# EAGLE design scHnRk_4 (EAGLE 7.5.0)
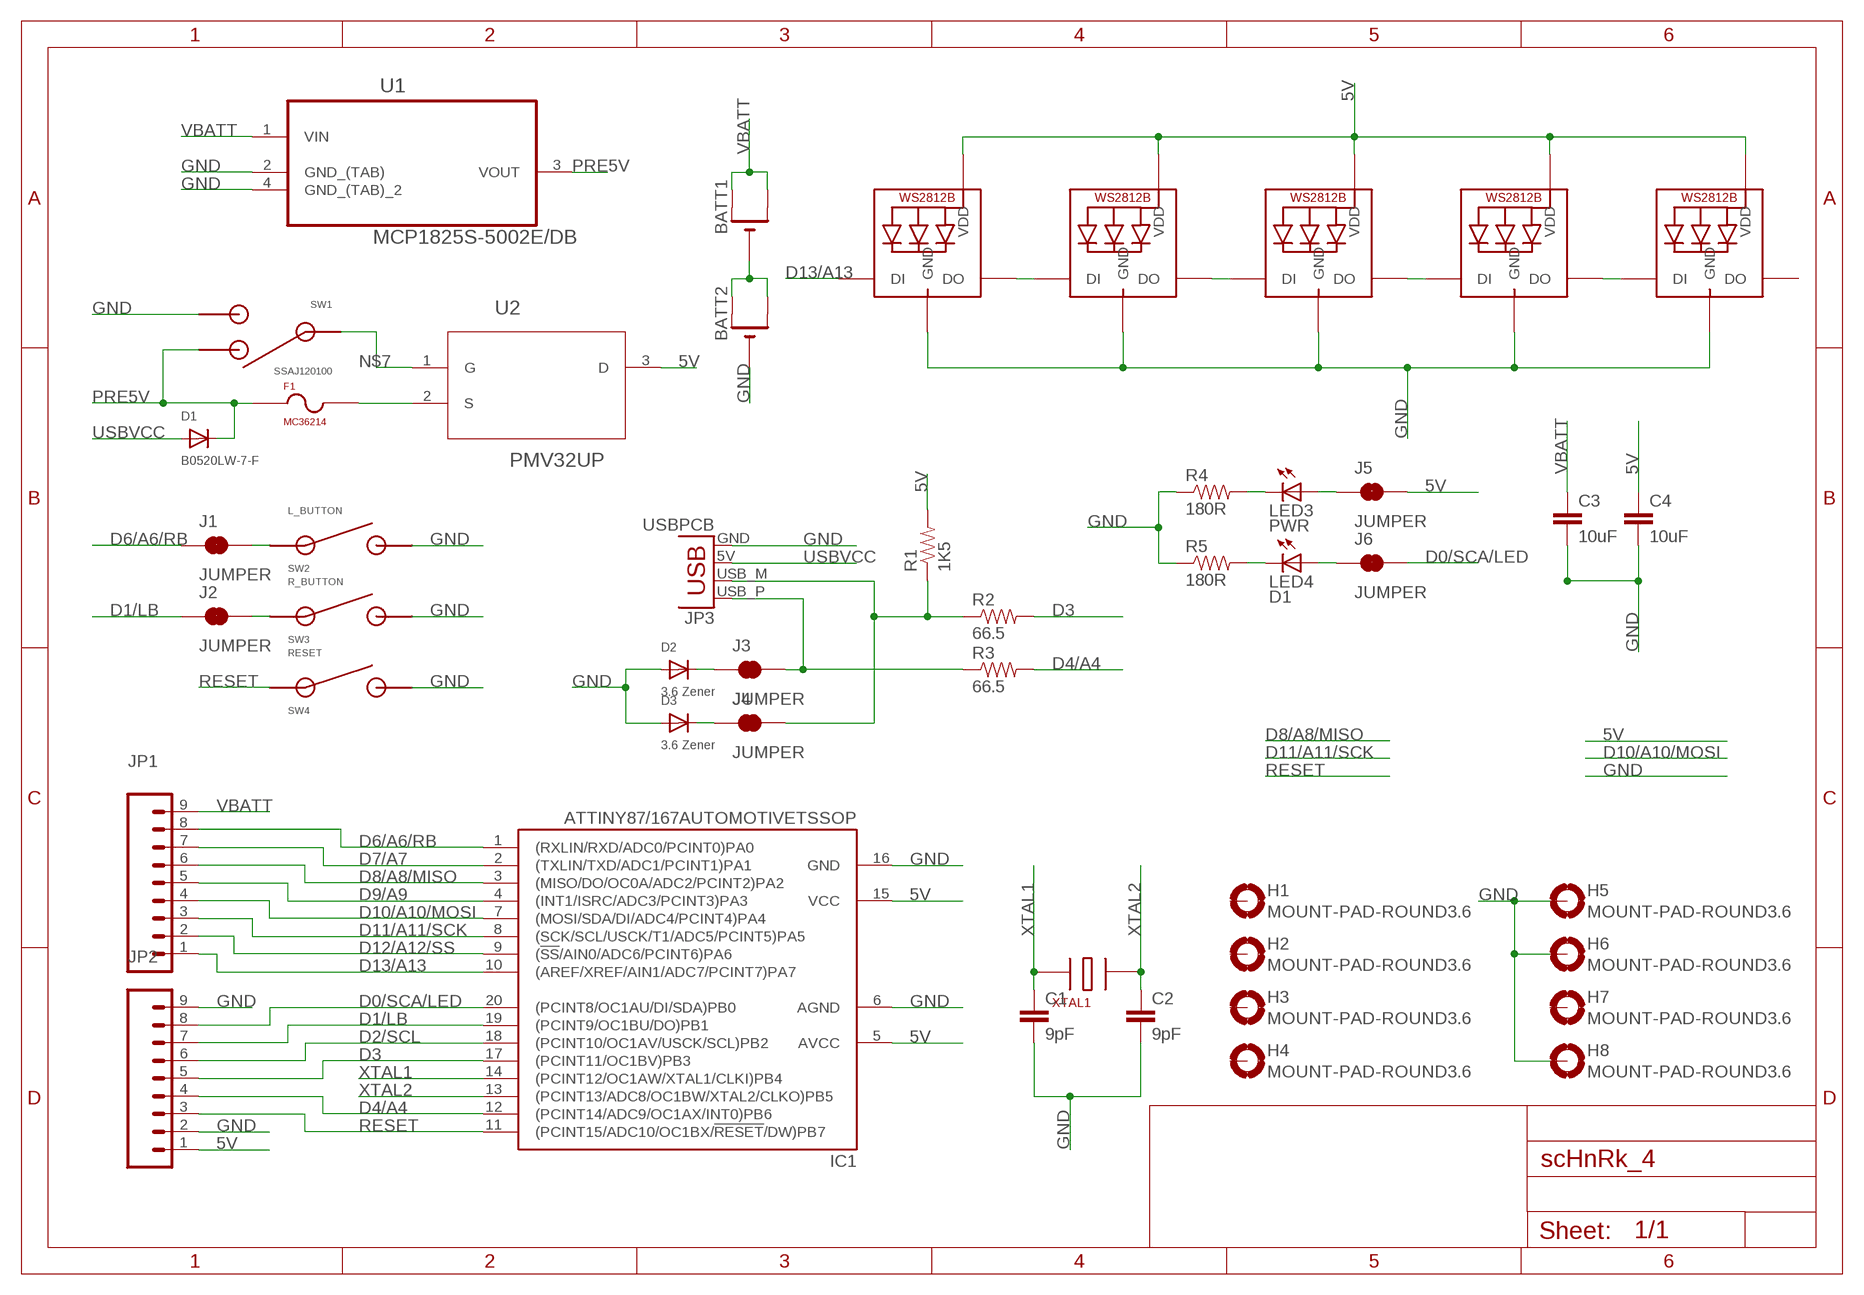
[diagram p0: schematic, sheet 1]

## Parts
BATT1  CR2032SMT  [CR2032-SMD]
BATT2  CR2032SMT  [CR2032-SMD]
C1  9pF  CAP0603-CAP  [0603-CAP]
C2  9pF  CAP0603-CAP  [0603-CAP]
C3  10uF  CAP0805  [0805]
C4  10uF  CAP0805  [0805]
D1  B0520LW-7-F  DIODESOD-123  [SOD-123]
D2  3.6 Zener  DIODESOD-523  [SOD-523]
D3  3.6 Zener  DIODESOD-523  [SOD-523]
F1  MC36214  [MC36214]
H1  MOUNT-PAD-ROUND3.6  [3,6-PAD]
H2  MOUNT-PAD-ROUND3.6  [3,6-PAD]
H3  MOUNT-PAD-ROUND3.6  [3,6-PAD]
H4  MOUNT-PAD-ROUND3.6  [3,6-PAD]
H5  MOUNT-PAD-ROUND3.6  [3,6-PAD]
H6  MOUNT-PAD-ROUND3.6  [3,6-PAD]
H7  MOUNT-PAD-ROUND3.6  [3,6-PAD]
H8  MOUNT-PAD-ROUND3.6  [3,6-PAD]
IC1  ATTINY87/167AUTOMOTIVETSSOP  [TSSOP20]
J1  JUMPER  JUMPER-PAD-2-NC_BY_TRACE  [PAD-JUMPER-2-NC_BY_TRACE_YES_SILK]
J2  JUMPER  JUMPER-PAD-2-NC_BY_TRACE  [PAD-JUMPER-2-NC_BY_TRACE_YES_SILK]
J3  JUMPER  JUMPER-PAD-2-NC_BY_TRACE  [PAD-JUMPER-2-NC_BY_TRACE_YES_SILK]
J4  JUMPER  JUMPER-PAD-2-NC_BY_TRACE  [PAD-JUMPER-2-NC_BY_TRACE_YES_SILK]
J5  JUMPER  JUMPER-PAD-2-NC_BY_TRACE  [PAD-JUMPER-2-NC_BY_TRACE_YES_SILK]
J6  JUMPER  JUMPER-PAD-2-NC_BY_TRACE  [PAD-JUMPER-2-NC_BY_TRACE_YES_SILK]
JP1  M09  [1X09]
JP2  M09  [1X09]
JP3  USBPCB  [USB-A-PCB]
LED1  WS2812B5050  [WS2812B]
LED2  WS2812B5050  [WS2812B]
LED3  PWR  LEDCHIPLED_0603  [CHIPLED_0603]
LED4  D1  LEDCHIPLED_0603  [CHIPLED_0603]
LED5  WS2812B5050  [WS2812B]
LED6  WS2812B5050  [WS2812B]
LED7  WS2812B5050  [WS2812B]
R1  1K5  RESISTOR0805-RES  [0805]
R2  66.5  RESISTOR0603-RES  [0603-RES]
R3  66.5  RESISTOR0603-RES  [0603-RES]
R4  180R  RESISTOR0805-RES  [0805]
R5  180R  RESISTOR0805-RES  [0805]
SW1  SSAJ120100  [SSAJ120100]
SW2  L_BUTTON  SKRBAGE010  [SKRBAGE010]
SW3  R_BUTTON  SKRBAGE010  [SKRBAGE010]
SW4  RESET  SKRBAGE010  [SKRBAGE010]
U1  MCP1825S-5002E/DB  [SOT230P700X180-4N]
U2  PMV32UP  [SOT95P230X110-3N]
XTAL1  16MHZ-2467444  [16MHZ-2467444]

## Nets
5V: C4.1 IC1.5(AVCC) IC1.15(VCC) J5.2 JP2.1 LED1.1-VDD(VDD) LED2.1-VDD(VDD) LED5.1-VDD(VDD) LED6.1-VDD(VDD) LED7.1-VDD(VDD) R1.2 U2.3(D)
D0/SCA/LED: IC1.20((PCINT8/OC1AU/DI/SDA)PB0) J6.2 JP2.8
D1/LB: IC1.19((PCINT9/OC1BU/DO)PB1) J2.1 JP2.7
D2/SCL: IC1.18((PCINT10/OC1AV/USCK/SCL)PB2) JP2.6
D3: IC1.17((PCINT11/OC1BV)PB3) JP2.5 R2.2
D4/A4: IC1.12((PCINT14/ADC9/OC1AX/INT0)PB6) JP2.4 R3.2
D6/A6/RB: IC1.1((RXLIN/RXD/ADC0/PCINT0)PA0) J1.1 JP1.8
D7/A7: IC1.2((TXLIN/TXD/ADC1/PCINT1)PA1) JP1.7
D8/A8/MISO: IC1.3((MISO/DO/OC0A/ADC2/PCINT2)PA2) JP1.6
D9/A9: IC1.4((INT1/ISRC/ADC3/PCINT3)PA3) JP1.5
D10/A10/MOSI: IC1.7((MOSI/SDA/DI/ADC4/PCINT4)PA4) JP1.4
D11/A11/SCK: IC1.8((SCK/SCL/USCK/T1/ADC5/PCINT5)PA5) JP1.3
D12/A12/SS: IC1.9((!SS!/AIN0/ADC6/PCINT6)PA6) JP1.2
D13/A13: IC1.10((AREF/XREF/AIN1/ADC7/PCINT7)PA7) JP1.1 LED1.4-DIN(DI)
GND: BATT2.- C1.2 C2.2 C3.2 C4.2 D2.A D3.A H5.B3,6(MOUNT) H6.B3,6(MOUNT) H8.B3,6(MOUNT) IC1.6(AGND) IC1.16(GND) JP2.2 JP2.9 JP3.GND LED1.3-GND(GND) LED2.3-GND(GND) LED5.3-GND(GND) LED6.3-GND(GND) LED7.3-GND(GND) R4.1 R5.1 SW1.P$2 SW2.P$2 SW2.P$4 SW3.P$2 SW3.P$4 SW4.P$2 SW4.P$4 U1.2(GND_(TAB)) U1.4(GND_(TAB)_2)
N$1: BATT1.- BATT2.+$1(+) BATT2.+$2(+1)
N$2: J1.2 SW2.P$1 SW2.P$3
N$3: LED1.2-DOUT(DO) LED2.4-DIN(DI)
N$4: LED2.2-DOUT(DO) LED5.4-DIN(DI)
N$5: LED5.2-DOUT(DO) LED6.4-DIN(DI)
N$6: LED6.2-DOUT(DO) LED7.4-DIN(DI)
N$7: SW1.P$C U2.1(G)
N$8: J2.2 SW3.P$1 SW3.P$3
N$9: D2.K(C) J3.1
N$10: D3.K(C) J4.1
N$15: J4.2 JP3.USB_M(D-) R1.1 R2.1
N$16: J3.2 JP3.USB_P(D+) R3.1
N$22: F1.P$2 U2.2(S)
N$28: LED3.C R4.2
N$29: LED4.C R5.2
N$31: J5.1 LED3.A
N$34: J6.1 LED4.A
PRE5V: D1.C F1.P$1 SW1.P$1 U1.3(VOUT)
RESET: IC1.11((PCINT15/ADC10/OC1BX/!RESET!/DW)PB7) JP2.3 SW4.P$1 SW4.P$3
USBVCC: D1.A JP3.5V(VBUS)
VBATT: BATT1.+$1(+) BATT1.+$2(+1) C3.1 JP1.9 U1.1(VIN)
XTAL1: C1.1 IC1.14((PCINT12/OC1AW/XTAL1/CLKI)PB4) XTAL1.P$1
XTAL2: C2.1 IC1.13((PCINT13/ADC8/OC1BW/XTAL2/CLKO)PB5) XTAL1.P$3
Unconnected: H1.B3,6(MOUNT) H2.B3,6(MOUNT) H3.B3,6(MOUNT) H4.B3,6(MOUNT) H7.B3,6(MOUNT) LED7.2-DOUT(DO)

## Library data of the parts
BATT1 BATT2 = adafruit:CR2032
C1-C4 = SparkFun-Passives:CAP: Capacitor Standard 0603 ceramic capacitor, and 0.1" leaded capacitor.
D1-D3 = adafruit:DIODE: Diode SMADIODE - SMA Surface Mount Package 20V 1A Schottky Diode Digikey: 641-1014-6-ND DO-1N4148 - Through Hole Small Current Diode SOD-123 20V 1 A (.5mV Vf) Schottky Diode - Digikey: MBRX120TPMSCT-ND SOD-323 10V 570mA (.38mV Vf, 3ns) Schottky Diode - Digikey: ZLLS410CT-ND SOD-523 30V 30mA Schottky Diode (RB751S-40TE61) - Digikey: RB751S-40TE61CT-ND SOT23-R/W - SOT23 Package (R = Solder Paste/Reflow Ovens, W = Hand-Soldering) BAT54Film 40V 300mA - Digikey: 497-7162-1-ND
F1 = scHnRk:MC36214
H1-H8 = holes:MOUNT-PAD-ROUND: MOUNTING PAD, round
IC1 = attiny87_167_automotive:ATTINY87/167AUTOMOTIVE
J1-J6 = SparkFun-Passives:JUMPER-PAD-2-NC_BY_TRACE
JP1 JP2 = SparkFun-Connectors:M09: Header 9 Standard 9-pin 0.1" header. Use with straight break away headers (SKU : PRT-00116), right angle break away headers (PRT-00553), swiss pins (PRT-00743), machine pins (PRT-00117), and female headers (PRT-00115).
JP3 = SparkFun-Connectors:USB: USB Connectors USB-B-PTH is fully proven SKU : PRT-00139/CONN-08278 USB-miniB is fully proven SKU : PRT-00587 USB-A-PCB is untested. USB-A-H is throughly reviewed, but untested. Spark Fun Electronics SKU : PRT-00437 USB-B-SMT is throughly reviewed, but untested. Needs silkscreen touching up. USB-A-S has not been used/tested USB-MB-H has not been used/tested USB-MICROB has been used. CONN-09505
LED1 LED2 LED5-LED7 = adafruit:WS2812B
LED3 LED4 = adafruit:LED: LED OSRAM: - CHIPLED LG R971, LG N971, LY N971, LG Q971, LY Q971, LO R971, LY R971 LH N974, LH R974 LS Q976, LO Q976, LY Q976 LO Q996 - Hyper CHIPLED LW Q18S LB Q993, LB Q99A, LB R99A - SideLED LS A670, LO A670, LY A670, LG A670, LP A670 LB A673, LV A673, LT A673, LW A673 LH A674 LY A675 LS A676, LA A676, LO A676, LY A676, LW A676 LS A679, LY A679, LG A679 - Hyper Micro SIDELED® LS Y876, LA Y876, LO Y876, LY Y876 LT Y87S - SmartLED LW L88C, LW L88S LB L89C, LB L89S, LG L890 LS L89K, LO L89K, LY L89K LS L896, LA L896, LO L896, LY L896 - TOPLED LS T670, LO T670, LY T670, LG T670, LP T670 LSG T670, LSP T670, LSY T670, LOP T670, LYG T670 LG T671, LOG T671, LSG T671 LB T673, LV T673, LT T673, LW T673 LH T674 LS T676, LA T676, LO T676, LY T676, LB T676, LH T676, LSB T676, LW T676 LB T67C, LV T67C, LT T67C, LS T67K, LO T67K, LY T67K, LW E67C LS E67B, LA E67B, LO E67B, LY E67B, LB E67C, LV E67C, LT E67C LW T67C LS T679, LY T679, LG T679 LS T770, LO T770, LY T770, LG T770, LP T770 LB T773, LV T773, LT T773, LW T773 LH T774 LS E675, LA E675, LY E675, LS T675 LS T776, LA T776, LO T776, LY T776, LB T776 LHGB T686 LT T68C, LB T68C - Hyper Mini TOPLED® LB M676 - Mini TOPLED Santana® LG M470 LS M47K, LO M47K, LY M47K Source: http://www.osram.convergy.de/
R1-R5 = SparkFun-Passives:RESISTOR: Resistor Basic schematic elements and footprints for 0603, 1206, and PTH resistors.
SW1 = scHnRk:SSAJ120100
SW2-SW4 = scHnRk:SKRBAGE010
U1 = Microchip_By_element14_Batch_1:MCP1825S-5002E/DB: IC, LDO, 5.0V, 500MA; MPN: MCP1825S-5002E/DB; OC_FARNELL: 1578407; OC_NEWARK: 26M9964; PACKAGE: SOT-223-3; SUPPLIER: Microchip
U2 = NXP_By_element14_Batch_1:PMV32UP: P-channel Trench MOSFET; MPN: PMV32UP; OC_FARNELL: 1894624; OC_NEWARK: 47T2356; PACKAGE: SOT-3; SUPPLIER: NXP Semiconductors
XTAL1 = scHnRk:16MHZ-2467444

## Net classes
0 default: clearance 0.305 mm

## Board
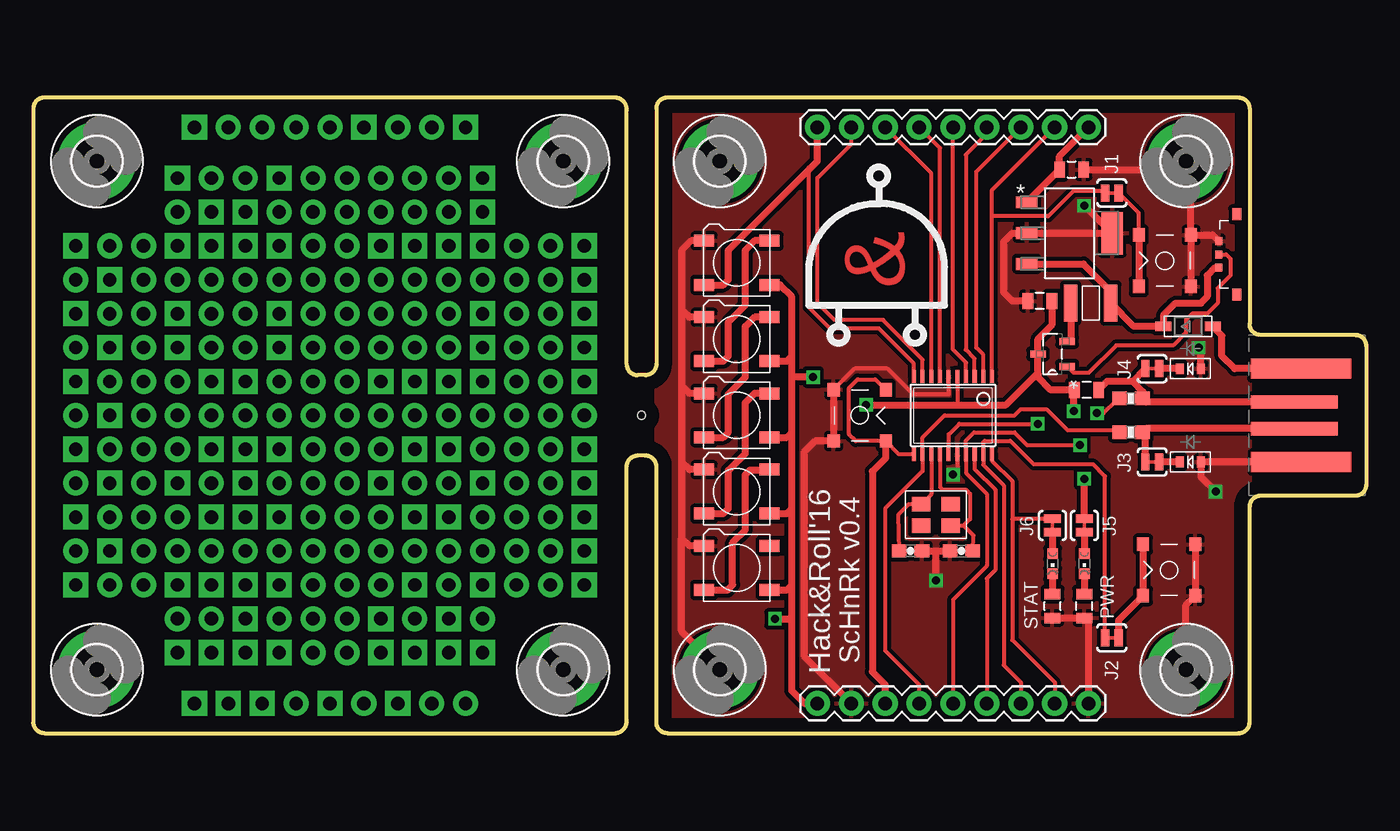
[diagram p1: board, top side]
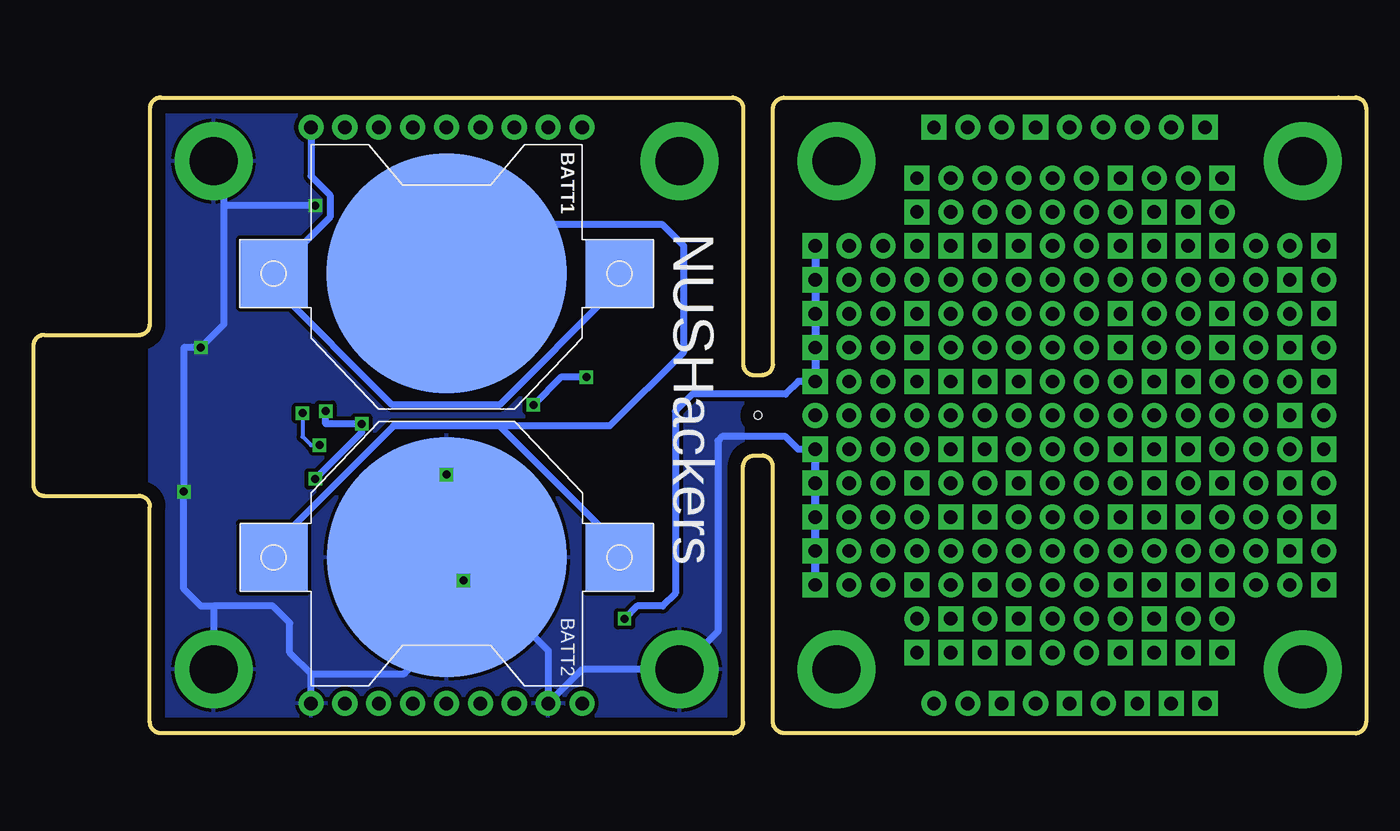
[diagram p2: board, bottom side, seen from below]

Size 99.85 x 47.62 mm. Coordinates in mm from the lower left corner, seen from the top.
Outline: 2.08,47.62 43.64,47.62 arc-90 44.45,46.65 44.45,27.64 arc90 45.26,26.83 45.86,26.83 arc90 46.67,27.64 46.67,46.81 arc-90 47.48,47.62 90.31,47.62 arc-90 91.12,46.81 91.12,30.66 arc90 91.94,29.84 99.04,29.84 arc-90 99.85,29.03 99.85,18.59 arc-90 99.04,17.78 91.94,17.78 arc90 91.12,16.97 91.12,0.81 arc-90 90.31,0 47.48,0 arc-90 46.67,0.81 46.67,19.98 arc90 45.86,20.8 45.26,20.8
Outline: 45.26,20.8 45.24,20.8
Outline: 45.26,20.8 arc90 44.45,19.98 44.45,0.97 arc-90 43.64,0 0.81,0 arc-90 0,0.81 0,46.81 arc-90 0.81,47.62 2.06,47.62
Copper layers (1*16): Top 0.035mm / dielectric 1.5mm / Bottom 0.035mm
Design rules "default *": minimum track width 10mil, minimum drill 24mil, track to track 12mil, track to pad 12mil, pad to pad 12mil, via to via 12mil, smd to smd 12mil, copper to edge 40mil, drill to drill 12mil, minimum pad ring 10mil, minimum via ring 8mil, stop-mask expansion 4mil, vias tented up to drill 0mil, thermal gap 10mil
Holes 0.6 mm at 45.56,23.81

### Footprints (pad centres in the part's own frame; a part is rotated, then mirrored left to right if it is on the bottom)
CR2032-SMD = smd 5.08 x 5.08: +$1 -12.954,0; +$2 12.954,0 | smd 18 x 18: - 0,0
0603-CAP = smd 1.1 x 1: 1 -0.85,0; 2 0.85,0
0805 = smd 0.8 x 1.2: 1 -0.9,0; 2 0.9,0
SOD-123 = smd 1.2 x 0.7: A 1.85,0; C -1.85,0
SOD-523 = smd 0.8 x 0.6: A 0,-0.8; K 0,0.8
MC36214 = smd 1 x 2.8: P$1 -1.5,0; P$2 1.5,0
3,6-PAD = drill 3.6 pad 5.842: B3,6 0,0
TSSOP20 = smd 0.305 x 0.991: 1 -2.925,-2.918; 2 -2.275,-2.918; 3 -1.625,-2.918; 4 -0.975,-2.918; 5 -0.325,-2.918; 6 0.325,-2.918; 7 0.975,-2.918; 8 1.625,-2.918; 9 2.275,-2.918; 10 2.925,-2.918; 11 2.925,2.918; 12 2.275,2.918; 13 1.625,2.918; 14 0.975,2.918; 15 0.325,2.918; 16 -0.325,2.918; 17 -0.975,2.918; 18 -1.625,2.918; 19 -2.275,2.918; 20 -2.925,2.918
PAD-JUMPER-2-NC_BY_TRACE_YES_SILK = smd 0.635 x 1.27: 1 -0.508,0; 2 0.508,0
1X09 = drill 1.016 pad 1.88: 1 0,0; 2 2.54,0; 3 5.08,0; 4 7.62,0; 5 10.16,0; 6 12.7,0; 7 15.24,0; 8 17.78,0; 9 20.32,0
USB-A-PCB = smd 7.5 x 1.5: 5V -0.2,-3.5; GND -0.2,3.5 | smd 6.5 x 1: USB_M 0.3,-1; USB_P 0.3,1
WS2812B = smd 1.5 x 0.9: 1-VDD 2.45,-1.65; 2-DOUT 2.45,1.65; 3-GND -2.45,1.65; 4-DIN -2.45,-1.65
CHIPLED_0603 = smd 0.8 x 0.8: A 0,-0.75; C 0,0.75
0603-RES = smd 1.1 x 1: 1 -0.85,0; 2 0.85,0
SSAJ120100 = smd 0.6 x 0.51: P$1 -1,1.36; P$2 1,1.36; P$C 0,1.36 | smd 0.9 x 0.7: P$3 -3,0; P$4 3,0
SKRBAGE010 = smd 1 x 0.9: P$1 -1.925,1.95; P$2 -1.925,-1.95; P$3 1.925,1.95; P$4 1.925,-1.95
SOT230P700X180-4N = smd 1.626 x 0.889: 1 -3.2,2.311; 2 -3.2,0; 3 -3.2,-2.311 | smd 1.626 x 3.175: 4 3.2,0
SOT95P230X110-3N = smd 1.168 x 0.533: 1 -1.092,0.94; 2 -1.092,-0.94; 3 1.092,0
16MHZ-2467444 = smd 1.4 x 1.1: P$1 -1.1,0.8; P$2 1.1,0.8; P$3 1.1,-0.8; P$4 -1.1,-0.8

### Placement (x,y rotation side)
BATT1  68.9,34.45 0 bottom
BATT2  68.88,13.18 180 bottom
C1  69.53,13.65 180 top
C2  65.72,13.65 0 top
C3  77.79,42.23 0 top
C4  75.41,32.38 180 top
D1  86.52,30.48 0 top
D2  86.68,20.32 90 top
D3  86.68,27.3 90 top
F1  79.22,32.23 180 top
H1  39.69,4.76 0 top
H2  4.76,4.76 0 top
H3  39.69,42.86 0 top
H4  4.76,42.86 0 top
H5  51.44,4.76 0 top
H6  86.36,42.86 0 top
H7  51.44,42.86 0 top
H8  86.36,4.76 0 top
IC1  68.9,23.81 180 top
J1  80.8,40.48 0 top
J2  80.8,7.14 0 top
J3  83.82,20.32 180 top
J4  83.82,27.3 180 top
J5  78.74,15.56 90 top
J6  76.36,15.56 90 top
JP1  58.74,45.4 0 top
JP2  58.74,2.22 0 top
JP3  94.77,23.81 180 top
LED1  52.7,35.24 0 top
LED2  52.7,29.53 0 top
LED3  78.74,12.7 180 top
LED4  76.36,12.7 180 top
LED5  52.7,23.81 0 top
LED6  52.7,18.1 0 top
LED7  52.7,12.38 0 top
R1  78.9,25.72 180 top
R2  82.23,25.08 180 top
R3  82.23,22.54 180 top
R4  78.74,9.53 90 top
R5  76.36,9.53 90 top
SW1  90.17,35.88 90 top
SW2  84.77,35.4 90 top
SW3  85.09,12.22 90 top
SW4  61.91,23.81 270 top
U1  77.63,37.47 0 top
U2  76.36,28.42 180 top
XTAL1  67.63,16.35 180 top

### Tracks (layer width: path | path; a pad name or v marks a point on that pad's centre or on a via)
5V  (via drill 0.6, 1 pad 1.88)
  Top 0.305: IC1.15 68.58,20.9 68.58,22.38 69.37,23.18 v75.25,23.18 | IC1.5 69.22,24.61
  Top 0.508: LED7.1-VDD 56.45,10.73 56.83,11.11 | LED1.1-VDD 55.94,33.59 56.83,32.7 56.83,28.26 | 56.83,11.11 56.83,16.83 | 56.83,16.83 56.83,22.54 | 56.83,22.54 56.83,26.67 | 56.83,26.67 56.83,28.26 | LED6.1-VDD 56.45,16.45 56.83,16.83 | LED5.1-VDD 56.45,22.16 56.83,22.54 | LED2.1-VDD 56.45,27.88 56.83,28.26 | JP2.1 57.78,2.22 56.83,3.17 56.83,8.57 | 56.83,8.57 56.83,11.11 | v55.56,8.57 56.83,8.57 | v58.42,26.67 56.83,26.67 | C4.1 76.31,30.59 75.27,29.55 U2.3 75.25,28.4 75.25,26.99 | v62.39,24.61 69.22,24.61 72.87,24.61 75.25,26.99 | 75.25,26.99 75.25,26.67 76.2,25.72 R1.2 77.95,25.66 v77.95,24.13 | J5.2 v78.74,19.05
  Bottom 0.508: v41.27,26.35 42.55,26.35 43.5,25.4 50.48,25.4 51.75,24.13 51.75,10.48 52.7,9.53 54.61,9.53 v55.56,8.57 | v58.42,26.67 60.33,26.67 v62.39,24.61 | v77.95,24.13 77.95,23.18 v75.25,23.18 75.25,22.54 v78.74,19.05
  Bottom 0.61: v41.27,36.51 v41.27,33.97 v41.27,31.43 v41.27,28.89 v41.27,26.35
D0/SCA/LED
  Top 0.305: IC1.20 71.82,20.41 73.34,18.89 73.34,16.03 | 73.34,16.03 73.34,6.99 76.52,3.81 JP2.8 | J6.2 73.37,16.07 73.34,16.03
D1/LB
  Top 0.305: JP2.7 73.98,3.81 72.71,5.08 72.71,18.57 71.17,20.11 IC1.19 71.17,21.8 71.28,21.91 73.18,21.91 74.93,20.16 79.38,20.16 80.3,19.24 J2.1
D2/SCL
  Top 0.305: IC1.18 70.52,19.81 72.07,18.26 72.07,12.22 71.44,11.59 JP2.6
D3  (via drill 0.6)
  Top 0.305: JP2.5 68.9,10 71.44,12.54 71.44,17.94 69.87,19.5 IC1.17 69.87,21.93 70.48,22.54 73.5,22.54 74.45,21.59 v78.42,21.59 | R2.2 81.6,24.87 81.06,24.87 80.17,23.97 v79.69,23.97
  Bottom 0.305: v79.69,23.97 79.69,22.23 79.06,21.59 v78.42,21.59
D4/A4
  Top 0.305: JP2.4 66.36,3.65 63.82,6.19 63.82,16.83 66.62,19.63 IC1.12 66.62,22.17 68.26,23.81 73.5,23.81 73.98,24.29 75.88,24.29 77.47,22.7 81.17,22.7 R3.2
D6/A6/RB
  Top 0.305: IC1.1 71.82,38.73 | 71.82,38.73 71.82,40.71 JP1.8 | 71.82,38.73 76.04,38.73 77.95,40.64 80.14,40.64 J1.1
D7/A7
  Top 0.305: IC1.2 71.17,28.36 70.64,28.89 70.64,42.07 JP1.7
D8/A8/MISO
  Top 0.305: IC1.3 70.52,28.06 69.85,28.73 69.85,43.34 71.44,44.93 JP1.6
D9/A9
  Top 0.305: JP1.5 68.9,28.73 69.87,27.76 IC1.4
D10/A10/MOSI
  Top 0.305: IC1.7 67.92,43.84 JP1.4
D11/A11/SCK
  Top 0.305: IC1.8 67.27,41.95 JP1.3
D12/A12/SS
  Top 0.305: IC1.9 66.62,27.99 63.66,30.96 60.01,30.96 58.74,32.23 58.74,41.59 61.28,44.13 JP1.2
D13/A13
  Top 0.305: IC1.10 65.97,27.69 63.34,30.32 59.69,30.32 58.1,31.91 58.1,42.23 58.18,42.31
  Top 0.508: LED1.4-DIN 51.69,33.59 52.07,33.97 52.07,36.2 58.18,42.31 58.74,42.86 JP1.1
GND  (via drill 0.6, 1 pad 1.88)
  Top 0.305: IC1.6 68.57,25.4 65.88,25.4 63.98,27.3 61.53,27.3 SW4.P$2 | IC1.16 69.22,19.69 v68.9,19.37
  Top 0.508: LED1.3-GND 49.27,36.89 48.58,36.2 48.58,31.75 | 48.58,31.75 48.58,26.04 | 48.58,26.04 48.58,20.32 | 48.58,20.32 48.58,14.61 | LED6.3-GND 49.15,19.75 48.58,20.32 | LED7.3-GND 49.15,14.03 48.58,14.61 | LED5.3-GND 49.15,25.46 48.58,26.04 | LED2.3-GND 49.15,31.18 48.58,31.75 | SW2.P$4 SW2.P$2 | SW3.P$4 SW3.P$2 86.36,9.62 H8.B3,6 | JP3.GND D2.A | D2.A | D2.A 87.48,19.2 v88.58,18.1 | H5.B3,6 48.58,7.62 48.58,14.61 | SW4.P$2 SW4.P$4 58.56,21.89 57.78,21.11 57.78,5.71 JP2.2 | R5.1 R4.1 79.06,8.36 JP2.9 | C3.2 85.72,42.23 H6.B3,6 86.72,42.5 SW2.P$4 | SW2.P$4 88.36,37.33 SW1.P$2 | D3.A 87.48,28.73 v87.31,28.89 | C4.2 73.34,32.38 72.71,33.02 72.71,36.83 73.34,37.47 U1.2 U1.4 80.8,37.47 v78.74,39.53 | v67.63,11.43 67.63,13.65 | 67.63,13.65 C1.2 | C2.2 67.63,13.65
  Bottom 0.305: v68.9,19.37 68.9,12.7 v67.63,11.43
  Bottom 0.508: 67.63,6.03 68.89,7.29 68.89,7.62 | v41.27,21.27 42.55,21.27 43.5,22.23 48.26,22.23 48.58,21.91 48.58,7.62 H5.B3,6 58.74,4.76 JP2.2 61.28,6.19 66.52,11.43 v67.63,11.43 68.89,12.69 BATT2.- 68.89,7.62 | 79.06,4.45 80.64,6.03 80.64,8.26 81.92,9.53 86.36,9.53 | 85.57,39.69 85.57,30.64 v87.31,28.89 88.58,28.89 v88.58,18.1 88.58,10.79 87.31,9.53 86.36,9.53 | 85.57,39.69 85.57,42.07 H6.B3,6 | 86.36,9.53 H8.B3,6 | 79.06,4.45 72.06,4.45 68.89,7.62 | JP2.9 79.06,4.45 | v78.74,39.53 85.41,39.53 85.57,39.69
  Bottom 0.61: v41.27,21.27 v41.27,18.73 v41.27,16.19 v41.27,13.65 v41.27,11.11
  pour Top: 47.49,47.62 90.31,47.62 arc-90 91.12,46.81 91.12,0.81 arc-90 90.31,0 47.49,0 arc-90 46.67,0.81 46.67,46.81 arc-90
  pour Bottom: 47.49,47.62 90.31,47.62 arc-90 91.12,46.81 91.12,0.81 arc-90 90.31,0 47.49,0 arc-90 46.67,0.81 46.67,46.81 arc-90
N$1
  Bottom 0.508: 64.93,23.02 56.67,23.02 51.12,28.57 51.12,36.51 52.7,38.1 65.25,38.1 BATT1.- | 64.93,23.02 72.87,23.02 81.76,14.13 81.76,13.26 BATT2.+$2 | BATT2.+$1 55.93,14.81 56.73,14.81 64.93,23.02
N$2
  Top 0.305: SW2.P$3 82.82,38.97 J1.2
  Top 0.508: SW2.P$3 SW2.P$1
N$3
  Top 0.508: LED2.4-DIN 51.69,27.88 52.07,28.26 52.07,30.8 53.34,32.07 53.34,36.2 54.04,36.89 LED1.2-DOUT
N$4
  Top 0.508: LED5.4-DIN 51.69,22.16 52.07,22.54 52.07,25.4 53.34,26.67 53.34,30.48 54.04,31.18 LED2.2-DOUT
N$5
  Top 0.508: LED6.4-DIN 51.69,16.45 52.07,16.83 52.07,19.68 53.34,20.95 53.34,24.77 54.04,25.46 LED5.2-DOUT
N$6
  Top 0.508: LED6.2-DOUT 55.09,19.68 53.66,19.68 53.34,19.37 53.34,15.24 52.39,14.29 52.39,11.11 52.01,10.73 LED7.4-DIN
N$7
  Top 0.305: SW1.P$C 89.38,35.88 89.69,35.56 89.69,34.29 88.74,33.34 88.74,32.23 87.95,31.43 86.84,31.43 86.36,30.96 86.36,30 85.41,29.05 81.12,29.05 79.06,26.99 77.94,26.99 U2.1
N$8
  Top 0.508: SW3.P$3 SW3.P$1 81.31,8.47 J2.2
N$9
  Top 0.508: D2.K J3.1
N$10
  Top 0.508: D3.K J4.1
N$12  (via drill 1 pad 1.88)
  other vias: 41.27,23.81
N$13  (via drill 1 pad 1.88)
  other vias: 38.73,26.35
N$14  (via drill 1 pad 1.88)
  other vias: 29.84,2.22
N$15
  Top 0.508: JP3.USB_M 83.35,24.81 R2.1 83.13,25.58 82.36,26.35 | 82.36,26.35 J4.2 | 82.36,26.35 80.43,26.35 R1.1
N$16
  Top 0.508: JP3.USB_P 83.35,22.81 R3.1 83.31,22.31 J3.2
N$17  (via drill 1 pad 1.88)
  other vias: 38.73,28.89
N$18  (via drill 1 pad 1.88)
  other vias: 38.73,31.43
N$19  (via drill 1 pad 1.88)
  other vias: 38.73,33.97
N$22
  Top 0.508: F1.P$2 77.72,29.62 U2.2
N$28
  Top 0.508: LED3.C R4.2
N$29
  Top 0.508: LED4.C R5.2
N$30  (via drill 1 pad 1.88)
  other vias: 38.73,36.51
N$31
  Top 0.508: J5.1 LED3.A
N$32  (via drill 1 pad 1.88)
  other vias: 36.2,33.97
N$33  (via drill 1 pad 1.88)
  other vias: 36.2,31.43
N$34
  Top 0.508: J6.1 LED4.A
N$35  (via drill 1 pad 1.88)
  other vias: 36.2,28.89
N$36  (via drill 1 pad 1.88)
  other vias: 36.2,26.35
N$37  (via drill 1 pad 1.88)
  other vias: 38.73,23.81
N$38  (via drill 1 pad 1.88)
  other vias: 38.73,21.27
N$39  (via drill 1 pad 1.88)
  other vias: 38.73,18.73
N$42  (via drill 1 pad 1.88)
  other vias: 38.73,16.19
N$44  (via drill 1 pad 1.88)
  other vias: 38.73,13.65
N$45  (via drill 1 pad 1.88)
  other vias: 38.73,11.11
N$53  (via drill 1 pad 1.88)
  other vias: 36.2,21.27
N$54  (via drill 1 pad 1.88)
  other vias: 36.2,23.81
N$55  (via drill 1 pad 1.88)
  other vias: 33.66,26.35
N$56  (via drill 1 pad 1.88)
  other vias: 33.66,28.89
N$57  (via drill 1 pad 1.88)
  other vias: 33.66,31.43
N$58  (via drill 1 pad 1.88)
  other vias: 33.66,33.97
N$59  (via drill 1 pad 1.88)
  other vias: 36.2,36.51
N$64  (via drill 1 pad 1.88)
  other vias: 33.66,41.59
N$65  (via drill 1 pad 1.88)
  other vias: 33.66,39.05
N$66  (via drill 1 pad 1.88)
  other vias: 33.66,36.51
N$67  (via drill 1 pad 1.88)
  other vias: 31.11,33.97
N$68  (via drill 1 pad 1.88)
  other vias: 31.11,31.43
N$69  (via drill 1 pad 1.88)
  other vias: 31.11,28.89
N$70  (via drill 1 pad 1.88)
  other vias: 31.11,26.35
N$71  (via drill 1 pad 1.88)
  other vias: 33.66,23.81
N$72  (via drill 1 pad 1.88)
  other vias: 33.66,21.27
N$73  (via drill 1 pad 1.88)
  other vias: 33.66,18.73
N$74  (via drill 1 pad 1.88)
  other vias: 36.2,18.73
N$75  (via drill 1 pad 1.88)
  other vias: 36.2,16.19
N$76  (via drill 1 pad 1.88)
  other vias: 33.66,16.19
N$77  (via drill 1 pad 1.88)
  other vias: 36.2,13.65
N$78  (via drill 1 pad 1.88)
  other vias: 33.66,13.65
N$79  (via drill 1 pad 1.88)
  other vias: 33.66,11.11
N$80  (via drill 1 pad 1.88)
  other vias: 36.2,11.11
N$82  (via drill 1 pad 1.88)
  other vias: 33.66,8.57
N$83  (via drill 1 pad 1.88)
  other vias: 33.66,6.03
N$87  (via drill 1 pad 1.88)
  other vias: 31.11,21.27
N$88  (via drill 1 pad 1.88)
  other vias: 31.11,23.81
N$89  (via drill 1 pad 1.88)
  other vias: 28.57,26.35
N$90  (via drill 1 pad 1.88)
  other vias: 28.57,28.89
N$91  (via drill 1 pad 1.88)
  other vias: 28.57,31.43
N$92  (via drill 1 pad 1.88)
  other vias: 28.57,33.97
N$93  (via drill 1 pad 1.88)
  other vias: 31.11,36.51
N$94  (via drill 1 pad 1.88)
  other vias: 31.11,39.05
N$95  (via drill 1 pad 1.88)
  other vias: 31.11,41.59
N$96  (via drill 1 pad 1.88)
  other vias: 32.38,45.4
N$97  (via drill 1 pad 1.88)
  other vias: 29.84,45.4
N$98  (via drill 1 pad 1.88)
  other vias: 28.57,41.59
N$99  (via drill 1 pad 1.88)
  other vias: 28.57,39.05
N$100  (via drill 1 pad 1.88)
  other vias: 28.57,36.51
N$101  (via drill 1 pad 1.88)
  other vias: 26.04,33.97
N$102  (via drill 1 pad 1.88)
  other vias: 26.04,31.43
N$103  (via drill 1 pad 1.88)
  other vias: 26.04,28.89
N$104  (via drill 1 pad 1.88)
  other vias: 26.04,26.35
N$105  (via drill 1 pad 1.88)
  other vias: 28.57,23.81
N$106  (via drill 1 pad 1.88)
  other vias: 28.57,21.27
N$107  (via drill 1 pad 1.88)
  other vias: 28.57,18.73
N$108  (via drill 1 pad 1.88)
  other vias: 31.11,18.73
N$109  (via drill 1 pad 1.88)
  other vias: 31.11,16.19
N$110  (via drill 1 pad 1.88)
  other vias: 28.57,16.19
N$111  (via drill 1 pad 1.88)
  other vias: 31.11,13.65
N$112  (via drill 1 pad 1.88)
  other vias: 28.57,13.65
N$113  (via drill 1 pad 1.88)
  other vias: 28.57,11.11
N$114  (via drill 1 pad 1.88)
  other vias: 31.11,11.11
N$115  (via drill 1 pad 1.88)
  other vias: 31.11,8.57
N$116  (via drill 1 pad 1.88)
  other vias: 28.57,8.57
N$117  (via drill 1 pad 1.88)
  other vias: 28.57,6.03
N$118  (via drill 1 pad 1.88)
  other vias: 31.11,6.03
N$119  (via drill 1 pad 1.88)
  other vias: 32.38,2.22
N$120  (via drill 1 pad 1.88)
  other vias: 27.3,2.22
N$121  (via drill 1 pad 1.88)
  other vias: 26.04,21.27
N$122  (via drill 1 pad 1.88)
  other vias: 26.04,23.81
N$123  (via drill 1 pad 1.88)
  other vias: 23.5,26.35
N$124  (via drill 1 pad 1.88)
  other vias: 23.5,28.89
N$125  (via drill 1 pad 1.88)
  other vias: 23.5,31.43
N$126  (via drill 1 pad 1.88)
  other vias: 23.5,33.97
N$127  (via drill 1 pad 1.88)
  other vias: 26.04,36.51
N$128  (via drill 1 pad 1.88)
  other vias: 26.04,39.05
N$129  (via drill 1 pad 1.88)
  other vias: 26.04,41.59
N$130  (via drill 1 pad 1.88)
  other vias: 27.3,45.4
N$131  (via drill 1 pad 1.88)
  other vias: 24.77,45.4
N$132  (via drill 1 pad 1.88)
  other vias: 23.5,41.59
N$133  (via drill 1 pad 1.88)
  other vias: 23.5,39.05
N$134  (via drill 1 pad 1.88)
  other vias: 23.5,36.51
N$135  (via drill 1 pad 1.88)
  other vias: 20.95,33.97
N$136  (via drill 1 pad 1.88)
  other vias: 20.95,31.43
N$137  (via drill 1 pad 1.88)
  other vias: 20.95,28.89
N$138  (via drill 1 pad 1.88)
  other vias: 20.95,26.35
N$139  (via drill 1 pad 1.88)
  other vias: 23.5,23.81
N$140  (via drill 1 pad 1.88)
  other vias: 23.5,21.27
N$141  (via drill 1 pad 1.88)
  other vias: 23.5,18.73
N$142  (via drill 1 pad 1.88)
  other vias: 26.04,18.73
N$143  (via drill 1 pad 1.88)
  other vias: 26.04,16.19
N$144  (via drill 1 pad 1.88)
  other vias: 23.5,16.19
N$145  (via drill 1 pad 1.88)
  other vias: 26.04,13.65
N$146  (via drill 1 pad 1.88)
  other vias: 23.5,13.65
N$147  (via drill 1 pad 1.88)
  other vias: 23.5,11.11
N$148  (via drill 1 pad 1.88)
  other vias: 26.04,11.11
N$149  (via drill 1 pad 1.88)
  other vias: 26.04,8.57
N$150  (via drill 1 pad 1.88)
  other vias: 23.5,8.57
N$151  (via drill 1 pad 1.88)
  other vias: 23.5,6.03
N$152  (via drill 1 pad 1.88)
  other vias: 26.04,6.03
N$153  (via drill 1 pad 1.88)
  other vias: 24.77,2.22
N$154  (via drill 1 pad 1.88)
  other vias: 22.23,2.22
N$155  (via drill 1 pad 1.88)
  other vias: 20.95,21.27
N$156  (via drill 1 pad 1.88)
  other vias: 20.95,23.81
N$157  (via drill 1 pad 1.88)
  other vias: 18.41,26.35
N$158  (via drill 1 pad 1.88)
  other vias: 18.41,28.89
N$159  (via drill 1 pad 1.88)
  other vias: 18.41,31.43
N$160  (via drill 1 pad 1.88)
  other vias: 18.41,33.97
N$161  (via drill 1 pad 1.88)
  other vias: 20.95,36.51
N$162  (via drill 1 pad 1.88)
  other vias: 20.95,39.05
N$163  (via drill 1 pad 1.88)
  other vias: 20.95,41.59
N$164  (via drill 1 pad 1.88)
  other vias: 22.23,45.4
N$165  (via drill 1 pad 1.88)
  other vias: 19.68,45.4
N$166  (via drill 1 pad 1.88)
  other vias: 18.41,41.59
N$167  (via drill 1 pad 1.88)
  other vias: 18.41,39.05
N$168  (via drill 1 pad 1.88)
  other vias: 18.41,36.51
N$169  (via drill 1 pad 1.88)
  other vias: 15.88,33.97
N$170  (via drill 1 pad 1.88)
  other vias: 15.88,31.43
N$171  (via drill 1 pad 1.88)
  other vias: 15.88,28.89
N$172  (via drill 1 pad 1.88)
  other vias: 15.88,26.35
N$173  (via drill 1 pad 1.88)
  other vias: 18.41,23.81
N$174  (via drill 1 pad 1.88)
  other vias: 18.41,21.27
N$175  (via drill 1 pad 1.88)
  other vias: 18.41,18.73
N$176  (via drill 1 pad 1.88)
  other vias: 20.95,18.73
N$177  (via drill 1 pad 1.88)
  other vias: 20.95,16.19
N$178  (via drill 1 pad 1.88)
  other vias: 18.41,16.19
N$179  (via drill 1 pad 1.88)
  other vias: 20.95,13.65
N$180  (via drill 1 pad 1.88)
  other vias: 18.41,13.65
N$181  (via drill 1 pad 1.88)
  other vias: 18.41,11.11
N$182  (via drill 1 pad 1.88)
  other vias: 20.95,11.11
N$183  (via drill 1 pad 1.88)
  other vias: 20.95,8.57
N$184  (via drill 1 pad 1.88)
  other vias: 18.41,8.57
N$185  (via drill 1 pad 1.88)
  other vias: 18.41,6.03
N$186  (via drill 1 pad 1.88)
  other vias: 20.95,6.03
N$187  (via drill 1 pad 1.88)
  other vias: 19.68,2.22
N$188  (via drill 1 pad 1.88)
  other vias: 17.14,2.22
N$189  (via drill 1 pad 1.88)
  other vias: 15.88,21.27
N$190  (via drill 1 pad 1.88)
  other vias: 15.88,23.81
N$191  (via drill 1 pad 1.88)
  other vias: 13.34,26.35
N$192  (via drill 1 pad 1.88)
  other vias: 13.34,28.89
N$193  (via drill 1 pad 1.88)
  other vias: 13.34,31.43
N$194  (via drill 1 pad 1.88)
  other vias: 13.34,33.97
N$195  (via drill 1 pad 1.88)
  other vias: 15.88,36.51
N$196  (via drill 1 pad 1.88)
  other vias: 15.88,39.05
N$197  (via drill 1 pad 1.88)
  other vias: 15.88,41.59
N$198  (via drill 1 pad 1.88)
  other vias: 17.14,45.4
N$199  (via drill 1 pad 1.88)
  other vias: 14.61,45.4
N$200  (via drill 1 pad 1.88)
  other vias: 13.34,41.59
N$201  (via drill 1 pad 1.88)
  other vias: 13.34,39.05
N$202  (via drill 1 pad 1.88)
  other vias: 13.34,36.51
N$203  (via drill 1 pad 1.88)
  other vias: 10.79,33.97
N$204  (via drill 1 pad 1.88)
  other vias: 10.79,31.43
N$205  (via drill 1 pad 1.88)
  other vias: 10.79,28.89
N$206  (via drill 1 pad 1.88)
  other vias: 10.79,26.35
N$207  (via drill 1 pad 1.88)
  other vias: 13.34,23.81
N$208  (via drill 1 pad 1.88)
  other vias: 13.34,21.27
N$209  (via drill 1 pad 1.88)
  other vias: 13.34,18.73
N$210  (via drill 1 pad 1.88)
  other vias: 15.88,18.73
N$211  (via drill 1 pad 1.88)
  other vias: 15.88,16.19
N$212  (via drill 1 pad 1.88)
  other vias: 13.34,16.19
N$213  (via drill 1 pad 1.88)
  other vias: 15.88,13.65
N$214  (via drill 1 pad 1.88)
  other vias: 13.34,13.65
N$215  (via drill 1 pad 1.88)
  other vias: 13.34,11.11
N$216  (via drill 1 pad 1.88)
  other vias: 15.88,11.11
N$217  (via drill 1 pad 1.88)
  other vias: 15.88,8.57
N$218  (via drill 1 pad 1.88)
  other vias: 13.34,8.57
N$219  (via drill 1 pad 1.88)
  other vias: 13.34,6.03
N$220  (via drill 1 pad 1.88)
  other vias: 15.88,6.03
N$221  (via drill 1 pad 1.88)
  other vias: 14.61,2.22
N$222  (via drill 1 pad 1.88)
  other vias: 12.06,2.22
N$223  (via drill 1 pad 1.88)
  other vias: 10.79,21.27
N$224  (via drill 1 pad 1.88)
  other vias: 10.79,23.81
N$225  (via drill 1 pad 1.88)
  other vias: 8.26,26.35
N$226  (via drill 1 pad 1.88)
  other vias: 8.26,28.89
N$227  (via drill 1 pad 1.88)
  other vias: 8.26,31.43
N$228  (via drill 1 pad 1.88)
  other vias: 8.26,33.97
N$229  (via drill 1 pad 1.88)
  other vias: 10.79,36.51
N$230  (via drill 1 pad 1.88)
  other vias: 10.79,39.05
N$231  (via drill 1 pad 1.88)
  other vias: 10.79,41.59
N$232  (via drill 1 pad 1.88)
  other vias: 12.06,45.4
N$236  (via drill 1 pad 1.88)
  other vias: 8.26,36.51
N$237  (via drill 1 pad 1.88)
  other vias: 5.71,33.97
N$238  (via drill 1 pad 1.88)
  other vias: 5.71,31.43
N$239  (via drill 1 pad 1.88)
  other vias: 5.71,28.89
N$240  (via drill 1 pad 1.88)
  other vias: 5.71,26.35
N$241  (via drill 1 pad 1.88)
  other vias: 8.26,23.81
N$242  (via drill 1 pad 1.88)
  other vias: 8.26,21.27
N$243  (via drill 1 pad 1.88)
  other vias: 8.26,18.73
N$244  (via drill 1 pad 1.88)
  other vias: 10.79,18.73
N$245  (via drill 1 pad 1.88)
  other vias: 10.79,16.19
N$246  (via drill 1 pad 1.88)
  other vias: 8.26,16.19
N$247  (via drill 1 pad 1.88)
  other vias: 10.79,13.65
N$248  (via drill 1 pad 1.88)
  other vias: 8.26,13.65
N$249  (via drill 1 pad 1.88)
  other vias: 8.26,11.11
N$250  (via drill 1 pad 1.88)
  other vias: 10.79,11.11
N$251  (via drill 1 pad 1.88)
  other vias: 10.79,8.57
N$254  (via drill 1 pad 1.88)
  other vias: 10.79,6.03
N$257  (via drill 1 pad 1.88)
  other vias: 5.71,21.27
N$258  (via drill 1 pad 1.88)
  other vias: 5.71,23.81
N$259  (via drill 1 pad 1.88)
  other vias: 3.17,26.35
N$260  (via drill 1 pad 1.88)
  other vias: 3.17,28.89
N$261  (via drill 1 pad 1.88)
  other vias: 3.17,31.43
N$262  (via drill 1 pad 1.88)
  other vias: 3.17,33.97
N$263  (via drill 1 pad 1.88)
  other vias: 5.71,36.51
N$270  (via drill 1 pad 1.88)
  other vias: 3.17,36.51
N$275  (via drill 1 pad 1.88)
  other vias: 3.17,23.81
N$276  (via drill 1 pad 1.88)
  other vias: 3.17,21.27
N$277  (via drill 1 pad 1.88)
  other vias: 3.17,18.73
N$278  (via drill 1 pad 1.88)
  other vias: 5.71,18.73
N$279  (via drill 1 pad 1.88)
  other vias: 5.71,16.19
N$280  (via drill 1 pad 1.88)
  other vias: 3.17,16.19
N$281  (via drill 1 pad 1.88)
  other vias: 5.71,13.65
N$282  (via drill 1 pad 1.88)
  other vias: 3.17,13.65
N$283  (via drill 1 pad 1.88)
  other vias: 3.17,11.11
N$284  (via drill 1 pad 1.88)
  other vias: 5.71,11.11
PRE5V
  Top 0.508: U1.3 78.67,35.15 80.72,33.11 F1.P$1 82.46,30.48 D1.C 84.67,31.33 85.57,32.23 87.47,32.23 87.95,32.7 87.95,34.29 88.53,34.88 SW1.P$1
RESET
  Top 0.305: IC1.11 64.86,20.89 SW4.P$3 61.62,21.89 61.12,22.38 61.12,25.88 61.75,26.51 63.09,26.51 SW4.P$1 63.84,25.72
  Top 0.508: JP2.3 63.82,3.65 62.87,4.6 62.87,19.62 63.86,20.62 SW4.P$3
USBVCC
  Top 0.508: JP3.5V 90,27.31 89.06,28.26 89.06,29.79 D1.A
VBATT
  Top 0.508: JP1.9 76.89,43.23 C3.1 U1.1
  Bottom 0.508: 81.85,33.5 BATT1.+$1 77.63,38.67 77.63,40.32 79.06,41.75 JP1.9 | 81.85,33.5 81.85,32.64 | BATT1.+$2 55.94,33.12 56.42,33.12 64.93,24.61 72.96,24.61 81.85,33.5
XTAL1
  Top 0.305: IC1.14 67.92,18.44 68.1,18.26 69.85,18.26 70.17,17.94 70.17,16.03 69.69,15.55 | XTAL1.P$1 69.69,15.55 | C1.1 70.43,14.8 69.69,15.55
XTAL2
  Top 0.305: IC1.13 67.27,17.9 XTAL1.P$3 65.57,17.15 64.82,16.4 C2.1

### Text on the board
Top: &
tPlace: Hack&Roll'16
tNames: PWR | STAT | ScHnRk v0.4
bNames: NUSHackers